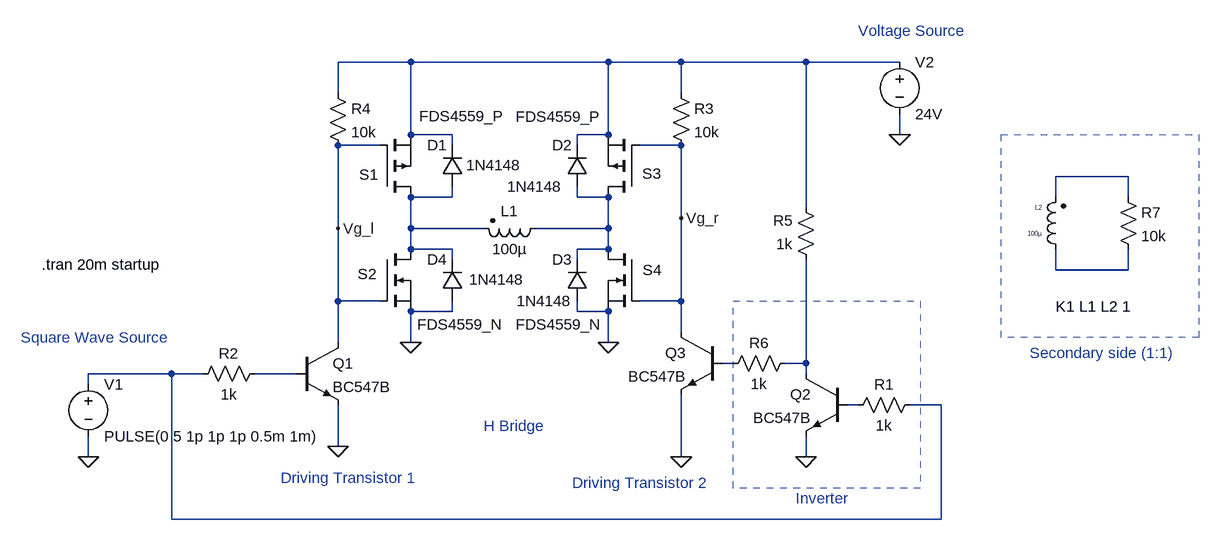
[diagram p0: schematic sample-circuit.asc]
sample-circuit.asc, the LTspice schematic file:
Version 4
SHEET 1 1604 680
WIRE 304 -352 192 -352
WIRE 608 -352 304 -352
WIRE 720 -352 608 -352
WIRE 912 -352 720 -352
WIRE 1056 -352 912 -352
WIRE 192 -304 192 -352
WIRE 720 -304 720 -352
WIRE 304 -240 304 -352
WIRE 368 -240 304 -240
WIRE 608 -240 608 -352
WIRE 608 -240 560 -240
WIRE 1056 -240 1056 -272
WIRE 256 -224 192 -224
WIRE 368 -224 368 -240
WIRE 560 -224 560 -240
WIRE 720 -224 656 -224
WIRE 1408 -176 1296 -176
WIRE 368 -144 368 -160
WIRE 368 -144 304 -144
WIRE 560 -144 560 -160
WIRE 608 -144 560 -144
WIRE 1296 -144 1296 -176
WIRE 1408 -144 1408 -176
WIRE 912 -128 912 -352
WIRE 720 -112 720 -224
WIRE 192 -96 192 -224
WIRE 304 -96 304 -144
WIRE 416 -96 304 -96
WIRE 608 -96 608 -144
WIRE 608 -96 496 -96
WIRE 304 -64 304 -96
WIRE 368 -64 304 -64
WIRE 608 -64 608 -96
WIRE 608 -64 560 -64
WIRE 368 -48 368 -64
WIRE 560 -48 560 -64
WIRE 1296 -32 1296 -64
WIRE 1408 -32 1408 -64
WIRE 1408 -32 1296 -32
WIRE 192 16 192 -96
WIRE 256 16 192 16
WIRE 720 16 720 -112
WIRE 720 16 656 16
WIRE 368 32 368 16
WIRE 368 32 304 32
WIRE 560 32 560 16
WIRE 608 32 560 32
WIRE 720 64 720 16
WIRE 192 80 192 16
WIRE 304 80 304 32
WIRE 608 80 608 32
WIRE 800 112 784 112
WIRE 912 112 912 -48
WIRE 912 112 880 112
WIRE -64 128 -192 128
WIRE -16 128 -64 128
WIRE 128 128 64 128
WIRE 912 128 912 112
WIRE -192 144 -192 128
WIRE 992 176 976 176
WIRE 1120 176 1072 176
WIRE 192 240 192 176
WIRE -192 256 -192 224
WIRE 720 256 720 160
WIRE 912 256 912 224
WIRE -64 352 -64 128
WIRE 1120 352 1120 176
WIRE 1120 352 -64 352
FLAG -192 256 0
FLAG 192 240 0
FLAG 304 80 0
FLAG 608 80 0
FLAG 1056 -240 0
FLAG 912 256 0
FLAG 720 256 0
FLAG 192 -96 Vg_l
FLAG 720 -112 Vg_r
SYMBOL nmos 256 -64 R0
WINDOW 0 -34 38 Left 2
WINDOW 3 58 116 Left 2
SYMATTR InstName S2
SYMATTR Value FDS4559_N
SYMBOL npn 128 80 R0
SYMATTR InstName Q1
SYMATTR Value BC547B
SYMBOL pmos 256 -144 M180
WINDOW 0 -31 35 Left 2
WINDOW 3 61 125 Left 2
SYMATTR InstName S1
SYMATTR Value FDS4559_P
SYMBOL pmos 656 -144 R180
WINDOW 0 -33 36 Left 2
WINDOW 3 59 124 Left 2
SYMATTR InstName S3
SYMATTR Value FDS4559_P
SYMBOL nmos 656 -64 M0
WINDOW 0 -34 32 Left 2
WINDOW 3 58 116 Left 2
SYMATTR InstName S4
SYMATTR Value FDS4559_N
SYMBOL res 704 -320 R0
SYMATTR InstName R3
SYMATTR Value 10k
SYMBOL res 176 -320 R0
SYMATTR InstName R4
SYMATTR Value 10k
SYMBOL voltage -192 128 R0
WINDOW 123 0 0 Left 0
WINDOW 39 0 0 Left 0
SYMATTR InstName V1
SYMATTR Value PULSE(0 5 1p 1p 1p 0.5m 1m)
SYMBOL res 80 112 R90
WINDOW 0 0 56 VBottom 2
WINDOW 3 32 56 VTop 2
SYMATTR InstName R2
SYMATTR Value 1k
SYMBOL voltage 1056 -368 R0
WINDOW 123 0 0 Left 0
WINDOW 39 0 0 Left 0
SYMATTR InstName V2
SYMATTR Value 24V
SYMBOL npn 976 128 M0
SYMATTR InstName Q2
SYMATTR Value BC547B
SYMBOL npn 784 64 M0
SYMATTR InstName Q3
SYMATTR Value BC547B
SYMBOL res 1088 160 R90
WINDOW 0 0 56 VBottom 2
WINDOW 3 32 56 VTop 2
SYMATTR InstName R1
SYMATTR Value 1k
SYMBOL res 896 96 R90
WINDOW 0 0 56 VBottom 2
WINDOW 3 32 56 VTop 2
SYMATTR InstName R6
SYMATTR Value 1k
SYMBOL res 928 -32 R180
WINDOW 0 36 76 Left 2
WINDOW 3 36 40 Left 2
SYMATTR InstName R5
SYMATTR Value 1k
SYMBOL ind2 512 -112 R90
WINDOW 0 5 56 VBottom 2
WINDOW 3 32 56 VTop 2
SYMATTR InstName L1
SYMATTR Value 100µ
SYMATTR Type ind
SYMBOL diode 384 -160 R180
WINDOW 0 24 64 Left 2
WINDOW 3 -90 33 Left 2
SYMATTR InstName D1
SYMATTR Value 1N4148
SYMBOL diode 576 -160 R180
WINDOW 0 24 64 Left 2
WINDOW 3 39 0 Left 2
SYMATTR InstName D2
SYMATTR Value 1N4148
SYMBOL diode 576 16 R180
WINDOW 0 24 64 Left 2
WINDOW 3 24 0 Left 2
SYMATTR InstName D3
SYMATTR Value 1N4148
SYMBOL diode 384 16 R180
WINDOW 0 24 64 Left 2
WINDOW 3 -95 33 Left 2
SYMATTR InstName D4
SYMATTR Value 1N4148
SYMBOL ind2 1312 -48 R180
WINDOW 0 36 80 Left 0
WINDOW 3 36 40 Left 0
SYMATTR InstName L2
SYMATTR Value 100µ
SYMATTR Type ind
SYMBOL res 1392 -160 R0
SYMATTR InstName R7
SYMATTR Value 10k
TEXT -264 -40 Left 2 !.tran 20m startup
TEXT 896 320 Left 2 ;Inverter
TEXT 416 208 Left 2 ;H Bridge
TEXT -296 72 Left 2 ;Square Wave Source
TEXT 992 -400 Left 2 ;Voltage Source
TEXT 104 288 Left 2 ;Driving Transistor 1
TEXT 552 296 Left 2 ;Driving Transistor 2
TEXT 1296 24 Left 2 !K1 L1 L2 1
TEXT 1256 96 Left 2 ;Secondary side (1:1)
RECTANGLE Normal 1088 304 800 16 2
RECTANGLE Normal 1212 -240 1516 72 2

The netlist it stands for:
* sample-circuit.asc
M§S2 N003 Vg_l 0 0 FDS4559_N
Q1 Vg_l N009 0 0 BC547B
M§S1 N003 Vg_l N001 N001 FDS4559_P
M§S3 N004 Vg_r N001 N001 FDS4559_P
M§S4 N004 Vg_r 0 0 FDS4559_N
R3 N001 Vg_r 10k
R4 N001 Vg_l 10k
V1 N008 0 PULSE(0 5 1p 1p 1p 0.5m 1m)
R2 N009 N008 1k
V2 N001 0 24V
Q2 N007 N010 0 0 BC547B
Q3 Vg_r N006 0 0 BC547B
R1 N008 N010 1k
R6 N007 N006 1k
R5 N007 N001 1k
L1 N004 N003 100µ
D1 N003 N001 1N4148
D2 N004 N001 1N4148
D3 0 N004 1N4148
D4 0 N003 1N4148
L2 N005 N002 100µ
R7 N002 N005 10k
.model D D
.lib standard.dio
.model NPN NPN
.model PNP PNP
.lib standard.bjt
.model NMOS NMOS
.model PMOS PMOS
.lib standard.mos
.tran 20m startup
* Inverter
* H Bridge
* Square Wave Source
* Voltage Source
* Driving Transistor 1
* Driving Transistor 2
K1 L1 L2 1
* Secondary side (1:1)
.backanno
.end